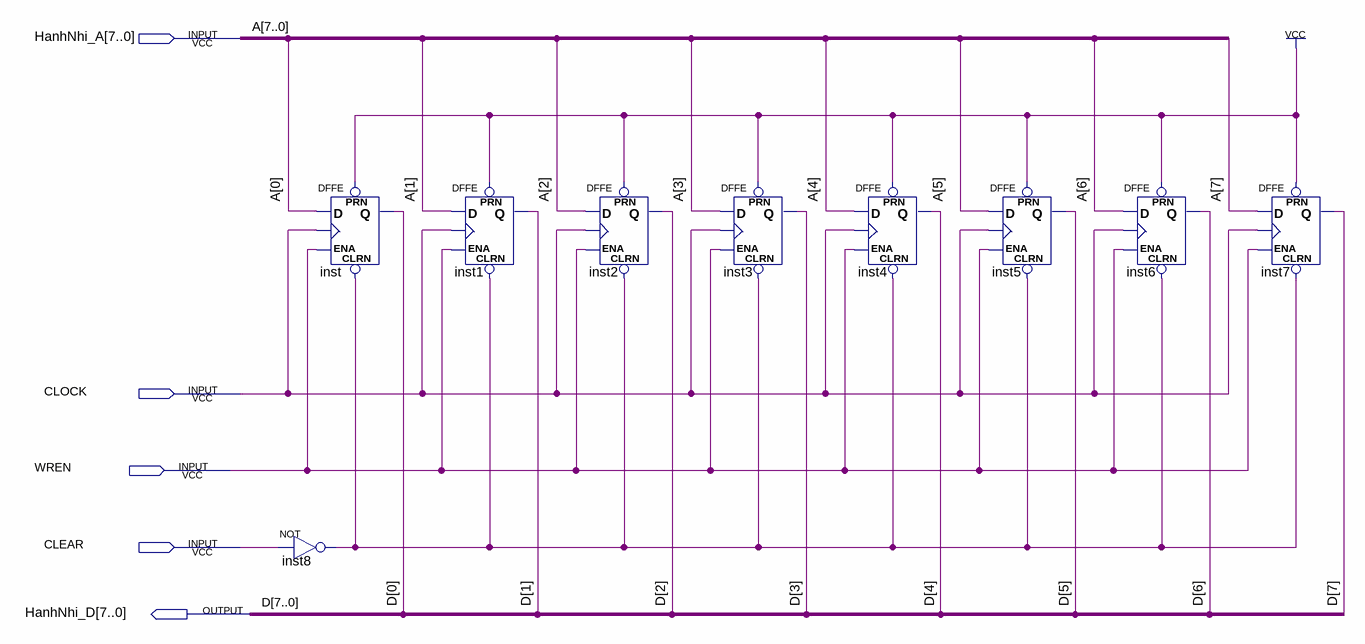
[diagram p0: schematic sheet]
// Quartus schematic register8.bdf as structural Verilog: 9 symbols, 5 pins
module register8 (
  input  [7:0] HanhNhi_A,
  input  CLOCK,
  input  WREN,
  input  CLEAR,
  output [7:0] HanhNhi_D
);

  wire inst8_out;

  not inst8 (inst8_out, CLEAR);
  DFFE inst (.PRN(1'b1), .CLRN(inst8_out), .D(HanhNhi_A[0]), .CLK(CLOCK), .ENA(WREN), .Q(HanhNhi_D[0]));
  DFFE inst1 (.PRN(1'b1), .CLRN(inst8_out), .D(HanhNhi_A[1]), .CLK(CLOCK), .ENA(WREN), .Q(HanhNhi_D[1]));
  DFFE inst2 (.PRN(1'b1), .CLRN(inst8_out), .D(HanhNhi_A[2]), .CLK(CLOCK), .ENA(WREN), .Q(HanhNhi_D[2]));
  DFFE inst3 (.PRN(1'b1), .CLRN(inst8_out), .D(HanhNhi_A[3]), .CLK(CLOCK), .ENA(WREN), .Q(HanhNhi_D[3]));
  DFFE inst4 (.PRN(1'b1), .CLRN(inst8_out), .D(HanhNhi_A[4]), .CLK(CLOCK), .ENA(WREN), .Q(HanhNhi_D[4]));
  DFFE inst5 (.PRN(1'b1), .CLRN(inst8_out), .D(HanhNhi_A[5]), .CLK(CLOCK), .ENA(WREN), .Q(HanhNhi_D[5]));
  DFFE inst6 (.PRN(1'b1), .CLRN(inst8_out), .D(HanhNhi_A[6]), .CLK(CLOCK), .ENA(WREN), .Q(HanhNhi_D[6]));
  DFFE inst7 (.PRN(1'b1), .CLRN(inst8_out), .D(HanhNhi_A[7]), .CLK(CLOCK), .ENA(WREN), .Q(HanhNhi_D[7]));

  // Other names for the same wires on the sheet: A[7:0] = HanhNhi_A; D[7:0] = HanhNhi_D
endmodule
